# EAGLE design PIC18LF26K22 (EAGLE 6.1)
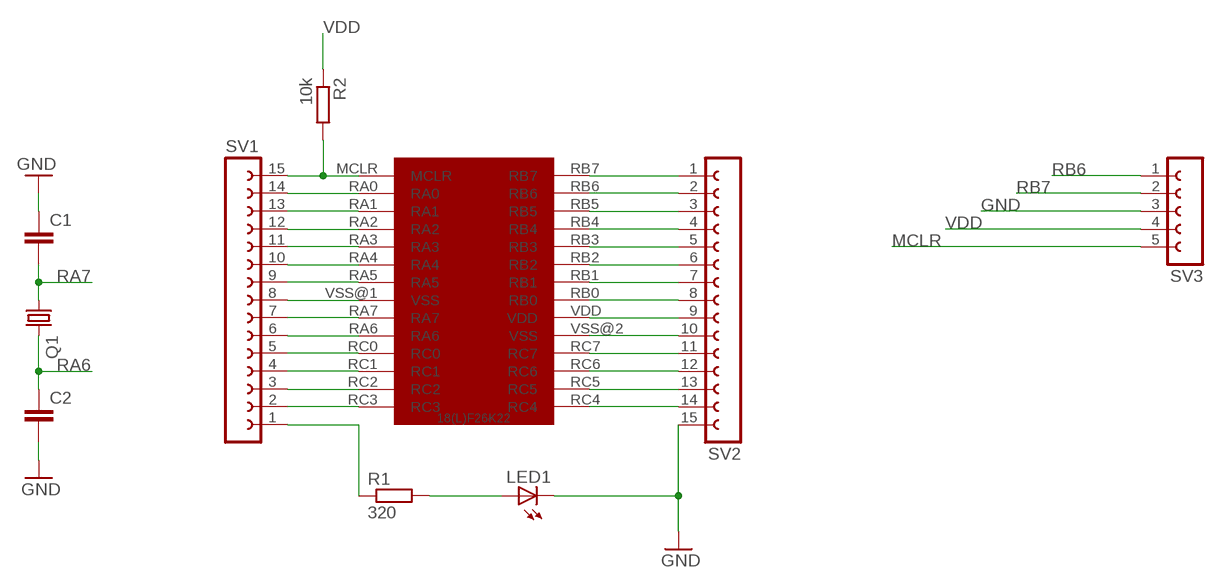
[diagram p0: schematic, sheet 1]

## Parts
C1  C-EU025-024X044  [C025-024X044]
C2  C-EU025-024X044  [C025-024X044]
LED1  LED5MM  [LED5MM]
Q1  CRYSTALHC49S  [HC49/S]
R1  320  R-EU_0207/10  [0207/10]
R2  10k  R-EU_0207/10  [0207/10]
SV1  FE15-1  [FE15]
SV2  FE15-1  [FE15]
SV3  FE05-1  [FE05-1]
U$1  PIC18(L)F26K22  [28-LEAD_SOIC]

## Nets
GND: C1.1 C2.2 LED1.K(C) SV1.8 SV2.10 SV2.15 SV3.3 U$1.VSS@1(VSS) U$1.VSS@2(VSS)
MCLR: R2.2 SV1.15 SV3.5 U$1.MCLR
N$1: R1.1 SV1.1
N$2: SV1.14 U$1.RA0
N$3: SV1.13 U$1.RA1
N$4: SV1.12 U$1.RA2
N$5: SV1.11 U$1.RA3
N$6: SV1.10 U$1.RA4
N$7: SV1.9 U$1.RA5
N$8: LED1.A R1.2
N$11: SV1.5 U$1.RC0
N$12: SV1.4 U$1.RC1
N$13: SV1.3 U$1.RC2
N$14: SV1.2 U$1.RC3
N$17: SV2.3 U$1.RB5
N$18: SV2.4 U$1.RB4
N$19: SV2.5 U$1.RB3
N$20: SV2.6 U$1.RB2
N$21: SV2.7 U$1.RB1
N$22: SV2.8 U$1.RB0
N$25: SV2.11 U$1.RC7
N$26: SV2.12 U$1.RC6
N$27: SV2.13 U$1.RC5
N$28: SV2.14 U$1.RC4
RA6: C2.1 Q1.2 SV1.6 U$1.RA6
RA7: C1.2 Q1.1 SV1.7 U$1.RA7
RB6: SV2.2 SV3.1 U$1.RB6
RB7: SV2.1 SV3.2 U$1.RB7
VDD: R2.1 SV2.9 SV3.4 U$1.VDD

## Library data of the parts
C1 C2 = rcl:C-EU: CAPACITOR, European symbol
LED1 = led:LED: LED OSRAM: - CHIPLED LG R971, LG N971, LY N971, LG Q971, LY Q971, LO R971, LY R971 LH N974, LH R974 LS Q976, LO Q976, LY Q976 LO Q996 - Hyper CHIPLED LW Q18S LB Q993, LB Q99A, LB R99A - SideLED LS A670, LO A670, LY A670, LG A670, LP A670 LB A673, LV A673, LT A673, LW A673 LH A674 LY A675 LS A676, LA A676, LO A676, LY A676, LW A676 LS A679, LY A679, LG A679 - Hyper Micro SIDELED® LS Y876, LA Y876, LO Y876, LY Y876 LT Y87S - SmartLED LW L88C, LW L88S LB L89C, LB L89S, LG L890 LS L89K, LO L89K, LY L89K LS L896, LA L896, LO L896, LY L896 - TOPLED LS T670, LO T670, LY T670, LG T670, LP T670 LSG T670, LSP T670, LSY T670, LOP T670, LYG T670 LG T671, LOG T671, LSG T671 LB T673, LV T673, LT T673, LW T673 LH T674 LS T676, LA T676, LO T676, LY T676, LB T676, LH T676, LSB T676, LW T676 LB T67C, LV T67C, LT T67C, LS T67K, LO T67K, LY T67K, LW E67C LS E67B, LA E67B, LO E67B, LY E67B, LB E67C, LV E67C, LT E67C LW T67C LS T679, LY T679, LG T679 LS T770, LO T770, LY T770, LG T770, LP T770 LB T773, LV T773, LT T773, LW T773 LH T774 LS E675, LA E675, LY E675, LS T675 LS T776, LA T776, LO T776, LY T776, LB T776 LHGB T686 LT T68C, LB T68C - Hyper Mini TOPLED® LB M676 - Mini TOPLED Santana® LG M470 LS M47K, LO M47K, LY M47K Source: http://www.osram.convergy.de LUXEON: - LUMILED® LXK2-PW12-R00, LXK2-PW12-S00, LXK2-PW14-U00, LXK2-PW14-V00 LXK2-PM12-R00, LXK2-PM12-S00, LXK2-PM14-U00 LXK2-PE12-Q00, LXK2-PE12-R00, LXK2-PE12-S00, LXK2-PE14-T00, LXK2-PE14-U00 LXK2-PB12-K00, LXK2-PB12-L00, LXK2-PB12-M00, LXK2-PB14-N00, LXK2-PB14-P00, LXK2-PB14-Q00 LXK2-PR12-L00, LXK2-PR12-M00, LXK2-PR14-Q00, LXK2-PR14-R00 LXK2-PD12-Q00, LXK2-PD12-R00, LXK2-PD12-S00 LXK2-PH12-R00, LXK2-PH12-S00 LXK2-PL12-P00, LXK2-PL12-Q00, LXK2-PL12-R00 Source: www.luxeon.com KINGBRIGHT: KA-3528ASYC Source: www.kingbright.com
Q1 = crystal:CRYSTAL: CRYSTAL; OC_FARNELL: 1667008; OC_NEWARK: unknown
R1 R2 = resistor:R-EU_: RESISTOR, European symbol
SV1 SV2 = con-lsta:FE15-1: FEMALE HEADER; OC_FARNELL: unknown; OC_NEWARK: unknown
SV3 = con-lsta:FE05-1: FEMALE HEADER; OC_FARNELL: unknown; OC_NEWARK: unknown
U$1 = PIC18:PIC18(L)F26K22

## Board
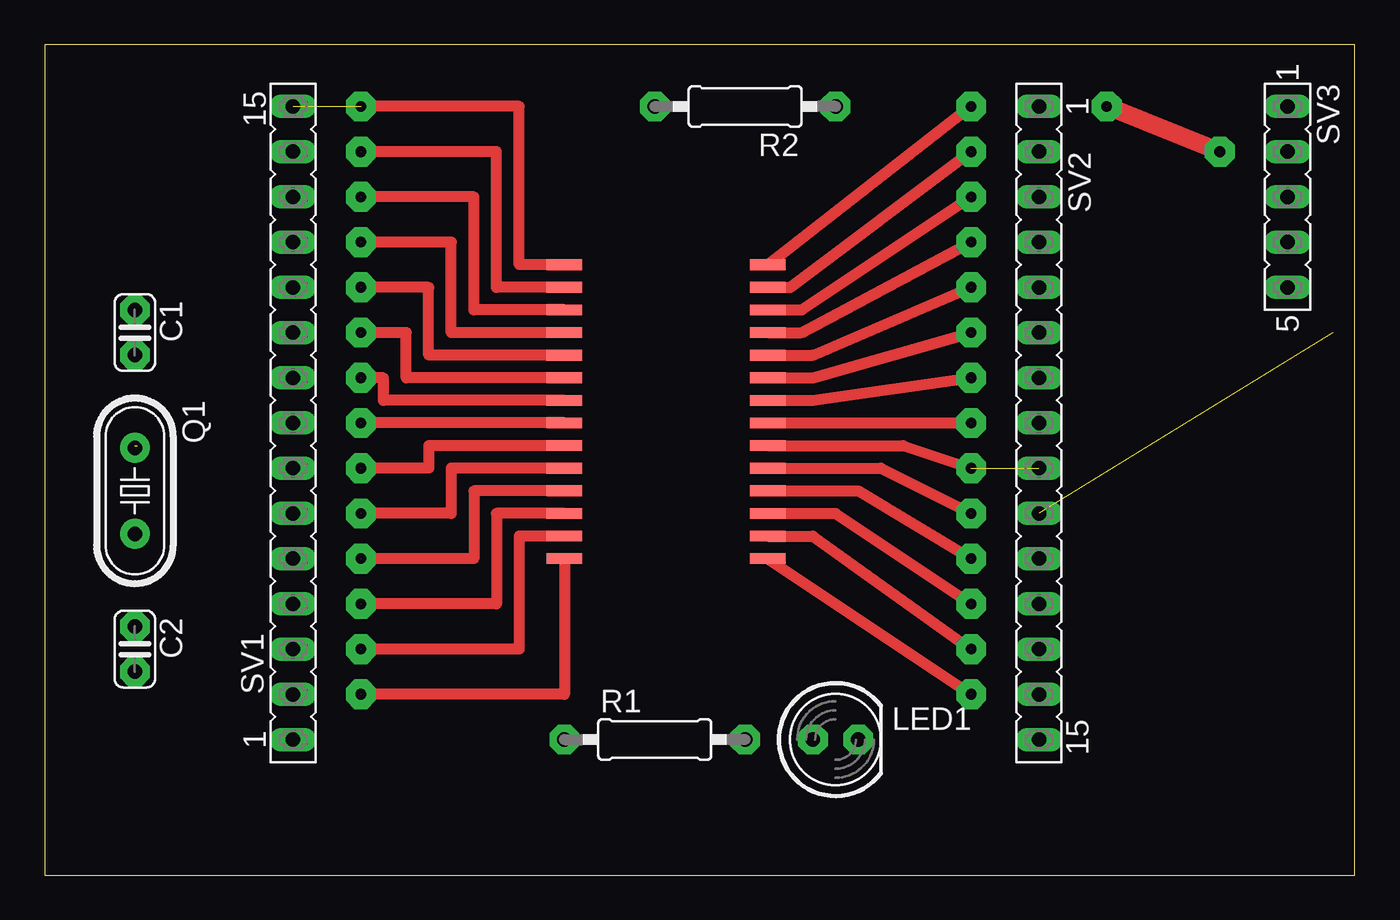
[diagram p1: board, top side]
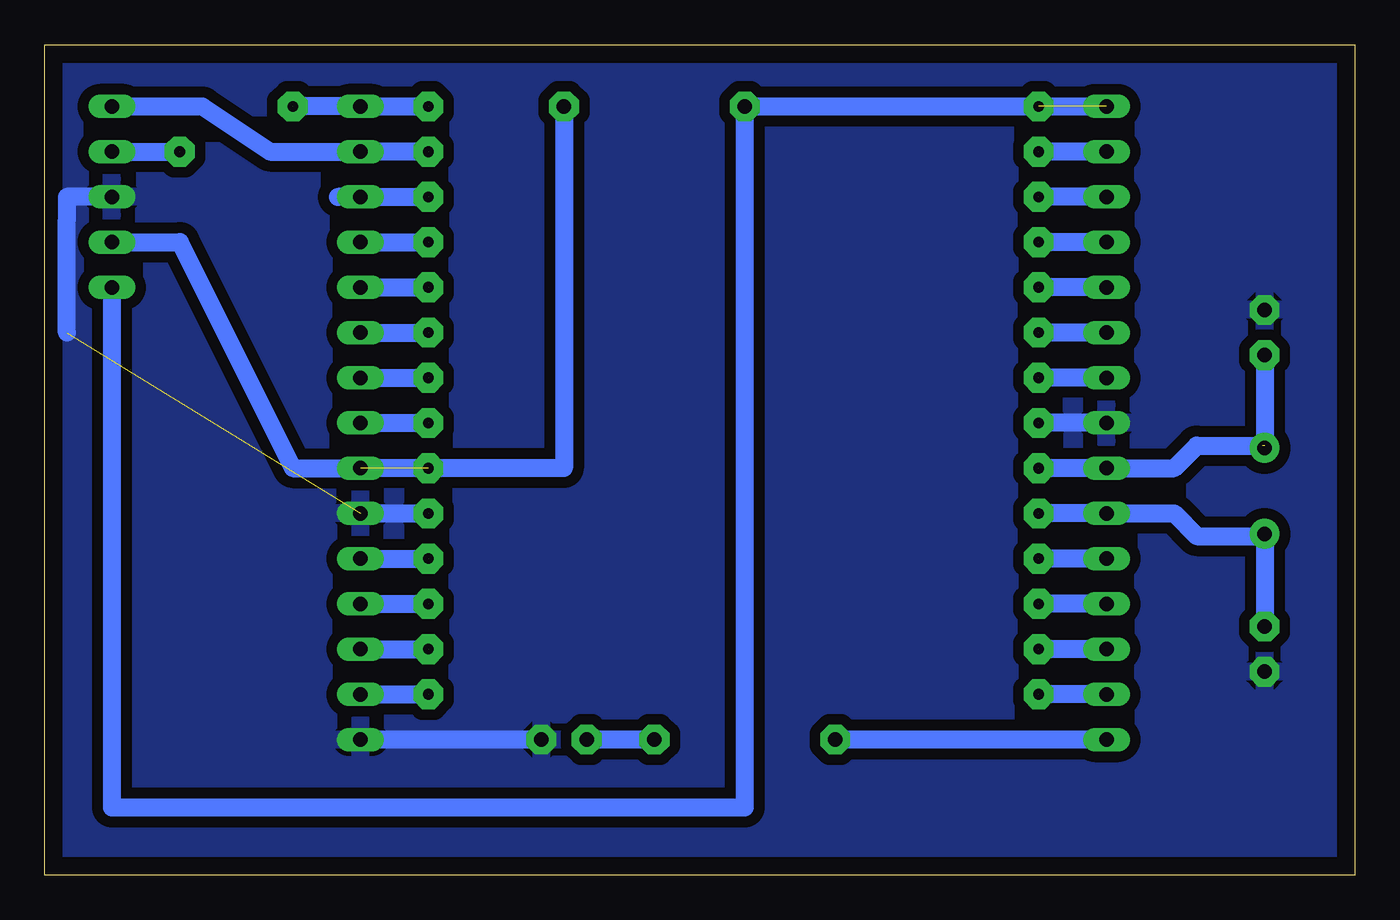
[diagram p2: board, bottom side, seen from below]

Size 73.64 x 46.66 mm. Coordinates in mm from the lower left corner, seen from the top.
Outline: 0,0 73.64,0 73.64,46.66 0,46.66 0,0
Copper layers (1*16): Top 0.035mm / dielectric 1.5mm / Bottom 0.035mm
Design rules: minimum track width 10mil, minimum drill 24mil, track to track 8mil, track to pad 8mil, pad to pad 8mil, via to via 8mil, smd to smd 8mil, copper to edge 40mil, drill to drill 8mil, minimum pad ring 10mil, minimum via ring 8mil, stop-mask expansion 4mil, vias tented up to drill 0mil, thermal gap 10mil

### Footprints (pad centres in the part's own frame; a part is rotated, then mirrored left to right if it is on the bottom)
C025-024X044 = drill 0.813 pad 1.676 octagon: 1 -1.27,0; 2 1.27,0
LED5MM = drill 0.813 pad 1.676 octagon: A -1.27,0; K 1.27,0
HC49/S = drill 0.813 pad 1.676: 1 -2.413,0; 2 2.413,0
0207/10 = drill 0.813 pad 1.676 octagon: 1 -5.08,0; 2 5.08,0
FE15 = drill 0.813 long: 1 -17.78,0; 2 -15.24,0; 3 -12.7,0; 4 -10.16,0; 5 -7.62,0; 6 -5.08,0; 7 -2.54,0; 8 0,0; 9 2.54,0; 10 5.08,0; 11 7.62,0; 12 10.16,0; 13 12.7,0; 14 15.24,0; 15 17.78,0
FE05-1 = drill 0.813 long: 1 -5.08,0; 2 -2.54,0; 3 0,0; 4 2.54,0; 5 5.08,0
28-LEAD_SOIC = smd 0.6 x 2: MCLR 0,0; RA0 1.27,0; RA1 2.54,0; RA2 3.81,0; RA3 5.08,0; RA4 6.35,0; RA5 7.62,0; RA6 11.43,0; RA7 10.16,0; RB0 8.89,11.43; RB1 7.62,11.43; RB2 6.35,11.43; RB3 5.08,11.43; RB4 3.81,11.43; RB5 2.54,11.43; RB6 1.27,11.43; RB7 0,11.43; RC0 12.7,0; RC1 13.97,0; RC2 15.24,0; RC3 16.51,0; RC4 16.51,11.43; RC5 15.24,11.43; RC6 13.97,11.43; RC7 12.7,11.43; VDD 10.16,11.43; VSS@1 8.89,0; VSS@2 11.43,11.43

### Placement (x,y rotation side)
C1  5.08,30.48 270 top
C2  5.08,12.7 270 top
LED1  44.45,7.62 0 top
Q1  5.08,21.59 270 top
R1  34.29,7.62 0 top
R2  39.37,43.18 180 top
SV1  13.97,25.4 90 top
SV2  55.88,25.4 270 top
SV3  69.85,38.1 270 top
U$1  29.21,34.29 270 top

### Tracks (layer width: path | path; a pad name or v marks a point on that pad's centre or on a via)
GND  (3 unrouted)
  Top 0.61: U$1.VSS@2 46.99,22.86 52.07,20.32 | U$1.VSS@1 17.78,25.4
  Bottom 1.016: SV2.10 52.07,20.32 | LED1.K SV2.15 | SV1.8 17.78,25.4 | SV3.3 72.39,38.1 72.39,36.83 72.39,30.48
  pour Bottom (isolate 0.61): 0,0 0,46.99 73.66,46.99 73.66,0
MCLR  (1 unrouted)
  Top 0.61: U$1.MCLR 26.67,34.29 26.67,43.18 17.78,43.18
  Bottom 1.016: SV3.5 69.85,3.81 34.29,3.81 R2.2 SV1.15
N$1
  Bottom 1.016: SV1.1 R1.1
N$2  (1 unrouted)
  Top 0.61: U$1.RA0 25.4,33.02 25.4,40.64 17.78,40.64
  Bottom 1.016: SV1.14 17.78,40.64
N$3  (1 unrouted)
  Top 0.61: U$1.RA1 24.13,31.75 24.13,38.1 17.78,38.1
  Bottom 1.016: SV1.13 17.78,38.1
N$4  (1 unrouted)
  Top 0.61: U$1.RA2 22.86,30.48 22.86,35.56 17.78,35.56
  Bottom 1.016: SV1.12 17.78,35.56
N$5  (1 unrouted)
  Top 0.61: U$1.RA3 21.59,29.21 21.59,33.02 17.78,33.02
  Bottom 1.016: SV1.11 17.78,33.02
N$6  (1 unrouted)
  Top 0.61: U$1.RA4 20.32,27.94 20.32,30.48 17.78,30.48
  Bottom 1.016: SV1.10 17.78,30.48
N$7  (1 unrouted)
  Top 0.61: U$1.RA5 19.05,26.67 19.05,27.94 17.78,27.94
  Bottom 1.016: SV1.9 17.78,27.94
N$8
  Bottom 1.016: R1.2 LED1.A
N$9  (via drill 0.6 pad 1.68)
  other vias: 17.78,43.18
N$10  (via drill 0.6 pad 1.68)
  other vias: 52.07,10.16
N$11  (1 unrouted)
  Top 0.61: U$1.RC0 24.13,21.59 24.13,17.78 17.78,17.78
  Bottom 1.016: SV1.5 17.78,17.78
N$12  (1 unrouted)
  Top 0.61: U$1.RC1 25.4,20.32 25.4,15.24 17.78,15.24
  Bottom 1.016: SV1.4 17.78,15.24
N$13  (1 unrouted)
  Top 0.61: U$1.RC2 26.67,19.05 26.67,12.7 17.78,12.7
  Bottom 1.016: SV1.3 17.78,12.7
N$14  (1 unrouted)
  Top 0.61: U$1.RC3 29.21,10.16 17.78,10.16
  Bottom 1.016: SV1.2 17.78,10.16
N$15  (via drill 0.6 pad 1.68)
  other vias: 52.07,12.7
N$16  (via drill 0.6 pad 1.68)
  other vias: 52.07,15.24
N$17  (1 unrouted)
  Top 0.61: U$1.RB5 42.55,31.75 52.07,38.1
  Bottom 1.016: 57.15,38.1 SV2.3 52.07,38.1
N$18  (1 unrouted)
  Top 0.61: U$1.RB4 42.55,30.48 52.07,35.56
  Bottom 1.016: SV2.4 52.07,35.56
N$19  (1 unrouted)
  Top 0.61: U$1.RB3 43.18,29.21 52.07,33.02
  Bottom 1.016: SV2.5 52.07,33.02
N$20  (1 unrouted)
  Top 0.61: U$1.RB2 43.18,27.94 52.07,30.48
  Bottom 1.016: SV2.6 52.07,30.48
N$21  (1 unrouted)
  Top 0.61: U$1.RB1 43.18,26.67 52.07,27.94
  Bottom 1.016: SV2.7 52.07,27.94
N$22  (1 unrouted)
  Top 0.61: U$1.RB0 52.07,25.4
  Bottom 1.016: SV2.8 52.07,25.4
N$23  (via drill 0.6 pad 1.68)
  other vias: 52.07,17.78
N$24  (via drill 0.6 pad 1.68)
  other vias: 52.07,20.32
N$25  (1 unrouted)
  Top 0.61: U$1.RC7 45.72,21.59 52.07,17.78
  Bottom 1.016: SV2.11 52.07,17.78
N$26  (1 unrouted)
  Top 0.61: U$1.RC6 44.45,20.32 52.07,15.24
  Bottom 1.016: SV2.12 52.07,15.24
N$27  (1 unrouted)
  Top 0.61: U$1.RC5 43.18,19.05 52.07,12.7
  Bottom 1.016: SV2.13 52.07,12.7
N$28  (1 unrouted)
  Top 0.61: U$1.RC4 52.07,10.16
  Bottom 1.016: SV2.14 52.07,10.16
N$29  (via drill 0.6 pad 1.68)
  other vias: 52.07,22.86
N$30  (via drill 0.6 pad 1.68)
  other vias: 52.07,25.4
N$31  (via drill 0.6 pad 1.68)
  other vias: 52.07,27.94
N$32  (via drill 0.6 pad 1.68)
  other vias: 52.07,30.48
N$33  (via drill 0.6 pad 1.68)
  other vias: 52.07,33.02
N$34  (via drill 0.6 pad 1.68)
  other vias: 52.07,35.56
N$35  (via drill 0.6 pad 1.68)
  other vias: 52.07,38.1
N$36  (via drill 0.6 pad 1.68)
  other vias: 52.07,40.64
N$37  (via drill 0.6 pad 1.68)
  other vias: 52.07,43.18
N$38  (via drill 0.6 pad 1.68)
  other vias: 17.78,10.16
N$39  (via drill 0.6 pad 1.68)
  other vias: 66.04,40.64
N$40  (via drill 0.6 pad 1.68)
  other vias: 17.78,12.7
N$41  (via drill 0.6 pad 1.68)
  other vias: 17.78,15.24
N$42  (via drill 0.6 pad 1.68)
  other vias: 17.78,17.78
N$43  (via drill 0.6 pad 1.68)
  other vias: 17.78,20.32
N$44  (via drill 0.6 pad 1.68)
  other vias: 17.78,22.86
N$45  (via drill 0.6 pad 1.68)
  other vias: 17.78,25.4
N$46  (via drill 0.6 pad 1.68)
  other vias: 17.78,27.94
N$47  (via drill 0.6 pad 1.68)
  other vias: 17.78,30.48
N$48  (via drill 0.6 pad 1.68)
  other vias: 17.78,33.02
N$49  (via drill 0.6 pad 1.68)
  other vias: 17.78,35.56
N$50  (via drill 0.6 pad 1.68)
  other vias: 17.78,38.1
N$51  (via drill 0.6 pad 1.68)
  other vias: 17.78,40.64
N$52  (via drill 0.6 pad 1.68)
  other vias: 59.69,43.18
RA6  (1 unrouted)
  Top 0.61: U$1.RA6 22.86,22.86 22.86,20.32 17.78,20.32
  Bottom 1.016: 17.78,20.32 SV1.6 10.16,20.32 8.89,19.05 5.08,19.05 | Q1.2 5.08,19.05 | 5.08,19.05 C2.1
RA7  (2 unrouted)
  Top 0.61: U$1.RA7 21.59,24.13 21.59,22.86 17.78,22.86
  Bottom 1.016: 17.78,22.86 SV1.7 10.16,22.86 8.89,24.13 5.21,24.13 Q1.1 | C1.2 5.08,24.13
RB6  (1 unrouted)
  Top 0.61: U$1.RB6 41.91,33.02 52.07,40.64
  Bottom 1.016: 52.07,40.64 SV2.2 60.96,40.64 64.77,43.18 SV3.1
RB7  (3 unrouted)
  Top 0.61: U$1.RB7 52.07,43.18
  Top 1.016: 66.04,40.64 59.69,43.18
  Bottom 1.016: 59.69,43.18 SV2.1 52.07,43.18 | SV3.2 66.04,40.64
VDD  (1 unrouted)
  Top 0.61: U$1.VDD 48.26,24.13 52.07,22.86
  Bottom 1.016: SV3.4 66.04,35.56 59.69,22.86 SV2.9 44.45,22.86 R2.1